# Altium schematic sheet GPS.SchDoc
size A; SheetNumber: 7; SheetTotal: 8
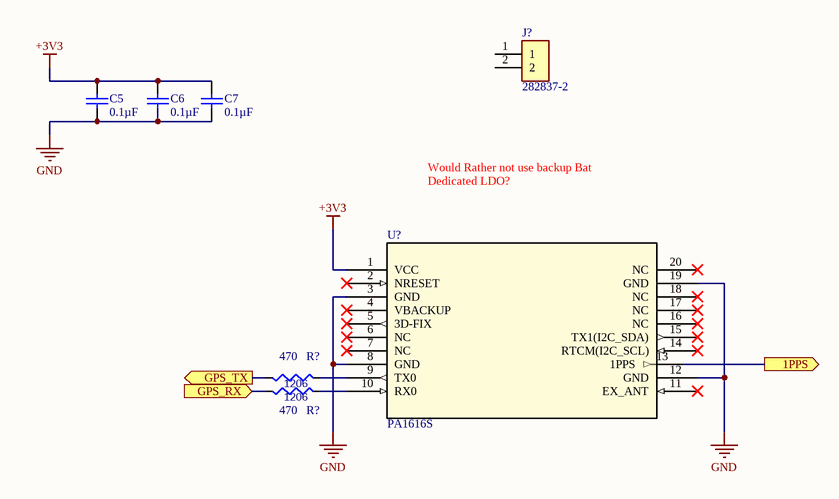
[diagram p0: GPS.SchDoc]

## Parts
(Parts that share a designator on the sheet are numbered #1, #2 ... from top to bottom, then left to right.)
C5  0.1µF  [C0603]
C6  0.1µF  [C0603]
C7  0.1µF  [C0603]
J?  282837-2  [Model Name]
R?#1  470  [R1206]
R?#2  470  [R1206]
U?  PA1616S  [PA1616S-Footprint-1]

## Ports
1PPS (out), GPS_RX (in), GPS_TX (out)

## Nets
+3V3: C5.2 C6.2 C7.2 U?.1(VCC)
GND: C5.1 C6.1 C7.1 U?.3(GND) U?.8(GND) U?.12(GND) U?.19(GND)
1PPS: U?.13(1PPS) ; port 1PPS
GPS_RX: R?#2.1 ; port GPS_RX
GPS_TX: R?#1.1 ; port GPS_TX
NetR?#1_2: R?#1.2 U?.9(TX0)
NetR?#2_2: R?#2.2 U?.10(RX0)

Not connected (* = marked no-connect by the designer): J? 1 2; U? 2(NRESET)* 4(VBACKUP)* 5(3D-FIX)* 6(NC)* 7(NC)* 11(EX_ANT)* 14(RTCM(I2C_SCL))* 15(TX1(I2C_SDA))* 16(NC)* 17(NC)* 18(NC)* 20(NC)*

## Notes on the sheet
- Would Rather not use backup Bat
- Dedicated LDO?
- (in symbol CMP-024-000067-4) 1206

## Library data of the parts
C5-C7 = ESD35C104K4T2A-24: CAP CER 0.1UF 50V X7R 0603; Made By: Brennan Swanton; Reviewed By: *; Supplier 1: Digi-Key; Supplier Part Number 1: 478-8009-1-ND
R?#1 R?#2 = CMP-024-000067-4: 470 OHM 1% 1/4W 1206; Made By: Jamie Smith; Source: Resistors.SchLib; Supplier Part Number 1: P470FCT-ND; Supplier 1: Digi-Key; Design Item ID: ERJ-8ENF4700V
U? = CMP-00103-1: Ultimate GPS Module - 66 channel w/10 Hz updates - PA1616S - MTK3339 Chipset; Part Number: 790; Supplier: adafruit